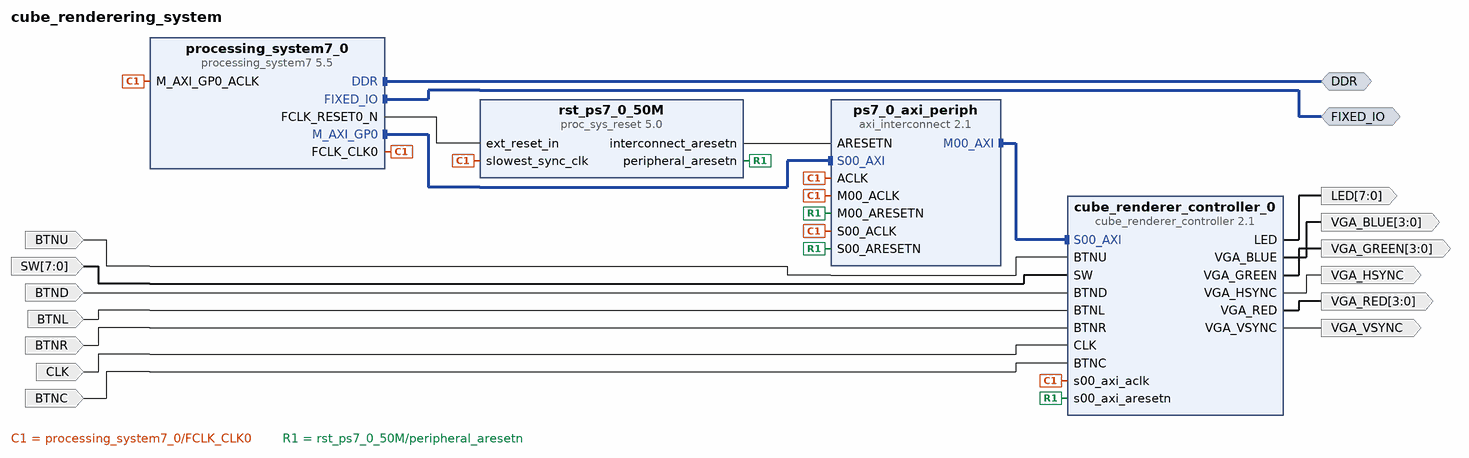
[diagram p0: block diagram of the top level]
# Vivado block design cube_renderering_system, xc7z020clg484-1, Vivado 2016.3
create_bd_design cube_renderering_system

create_bd_intf_port -mode Master -vlnv xilinx.com:interface:ddrx_rtl:1.0 DDR
create_bd_intf_port -mode Master -vlnv xilinx.com:display_processing_system7:fixedio_rtl:1.0 FIXED_IO
create_bd_port -dir I BTNU
create_bd_port -dir I -from 7 -to 0 SW
create_bd_port -dir O -from 3 -to 0 VGA_BLUE
create_bd_port -dir O VGA_HSYNC
create_bd_port -dir O -from 3 -to 0 VGA_GREEN
create_bd_port -dir O -from 3 -to 0 VGA_RED
create_bd_port -dir I BTND
create_bd_port -dir I BTNL
create_bd_port -dir I BTNR
create_bd_port -dir O VGA_VSYNC
create_bd_port -dir I -type clk CLK
create_bd_port -dir I BTNC
create_bd_port -dir O -from 7 -to 0 LED

create_bd_cell -type ip -vlnv xilinx.com:ip:processing_system7:5.5 processing_system7_0
set_property -dict {CONFIG.preset ZedBoard} [get_bd_cells processing_system7_0]
create_bd_cell -type ip -vlnv xilinx.com:ip:axi_interconnect:2.1 ps7_0_axi_periph
set_property -dict {CONFIG.NUM_MI 1} [get_bd_cells ps7_0_axi_periph]
create_bd_cell -type ip -vlnv xilinx.com:ip:proc_sys_reset:5.0 rst_ps7_0_50M
create_bd_cell -type ip -vlnv xilinx.com:user:cube_renderer_controller:2.1 cube_renderer_controller_0

# ---- connections ----

connect_bd_intf_net [get_bd_intf_pins processing_system7_0/M_AXI_GP0] [get_bd_intf_pins ps7_0_axi_periph/S00_AXI]
connect_bd_intf_net [get_bd_intf_pins ps7_0_axi_periph/M00_AXI] [get_bd_intf_pins cube_renderer_controller_0/S00_AXI]
connect_bd_intf_net [get_bd_intf_ports DDR] [get_bd_intf_pins processing_system7_0/DDR]
connect_bd_intf_net [get_bd_intf_ports FIXED_IO] [get_bd_intf_pins processing_system7_0/FIXED_IO]
connect_bd_net [get_bd_pins processing_system7_0/FCLK_CLK0] \
  [get_bd_pins processing_system7_0/M_AXI_GP0_ACLK] [get_bd_pins rst_ps7_0_50M/slowest_sync_clk] \
  [get_bd_pins ps7_0_axi_periph/S00_ACLK] [get_bd_pins ps7_0_axi_periph/ACLK] [get_bd_pins ps7_0_axi_periph/M00_ACLK] \
  [get_bd_pins cube_renderer_controller_0/s00_axi_aclk]
connect_bd_net [get_bd_pins processing_system7_0/FCLK_RESET0_N] [get_bd_pins rst_ps7_0_50M/ext_reset_in]
connect_bd_net [get_bd_pins rst_ps7_0_50M/peripheral_aresetn] \
  [get_bd_pins ps7_0_axi_periph/S00_ARESETN] [get_bd_pins ps7_0_axi_periph/M00_ARESETN] \
  [get_bd_pins cube_renderer_controller_0/s00_axi_aresetn]
connect_bd_net [get_bd_pins rst_ps7_0_50M/interconnect_aresetn] [get_bd_pins ps7_0_axi_periph/ARESETN]
connect_bd_net [get_bd_ports BTNU] [get_bd_pins cube_renderer_controller_0/BTNU]
connect_bd_net [get_bd_ports SW] [get_bd_pins cube_renderer_controller_0/SW]
connect_bd_net [get_bd_pins cube_renderer_controller_0/VGA_BLUE] [get_bd_ports VGA_BLUE]
connect_bd_net [get_bd_pins cube_renderer_controller_0/VGA_HSYNC] [get_bd_ports VGA_HSYNC]
connect_bd_net [get_bd_pins cube_renderer_controller_0/VGA_GREEN] [get_bd_ports VGA_GREEN]
connect_bd_net [get_bd_pins cube_renderer_controller_0/VGA_RED] [get_bd_ports VGA_RED]
connect_bd_net [get_bd_ports BTND] [get_bd_pins cube_renderer_controller_0/BTND]
connect_bd_net [get_bd_ports BTNL] [get_bd_pins cube_renderer_controller_0/BTNL]
connect_bd_net [get_bd_ports BTNR] [get_bd_pins cube_renderer_controller_0/BTNR]
connect_bd_net [get_bd_pins cube_renderer_controller_0/VGA_VSYNC] [get_bd_ports VGA_VSYNC]
connect_bd_net [get_bd_ports CLK] [get_bd_pins cube_renderer_controller_0/CLK]
connect_bd_net [get_bd_ports BTNC] [get_bd_pins cube_renderer_controller_0/BTNC]
connect_bd_net [get_bd_pins cube_renderer_controller_0/LED] [get_bd_ports LED]

# ---- address map ----
assign_bd_address -offset 0x43C00000 -range 64K -target_address_space [get_bd_addr_spaces processing_system7_0/Data] [get_bd_addr_segs cube_renderer_controller_0/S00_AXI/S00_AXI_reg]

validate_bd_design
save_bd_design
